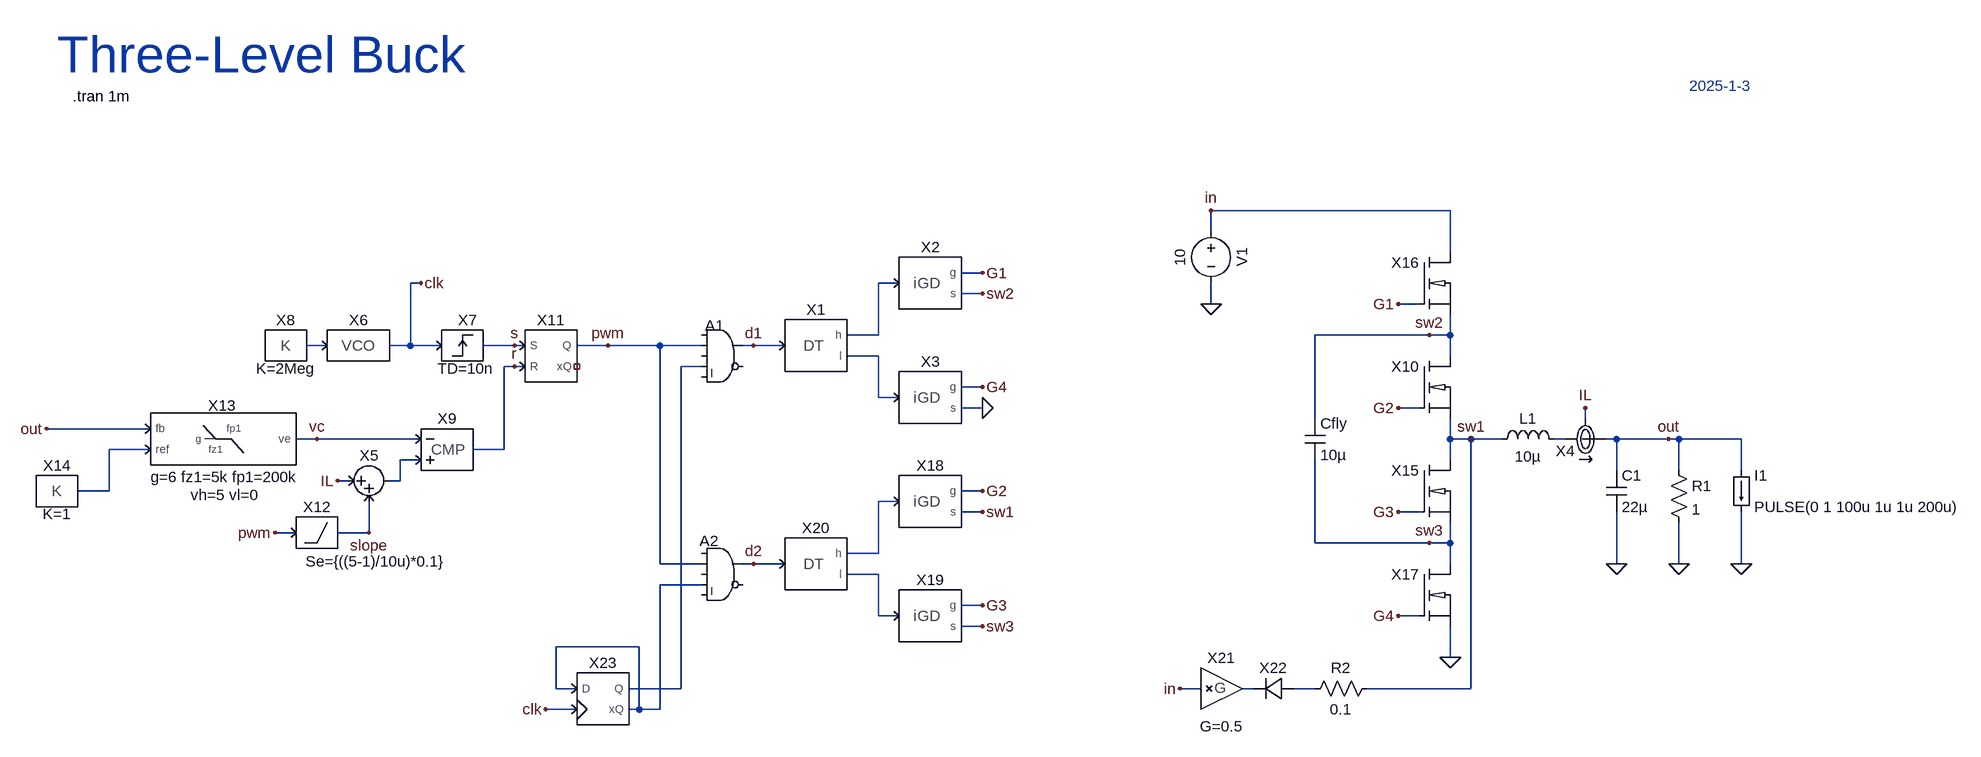
[diagram p0: schematic BUCK_3LV.asc]
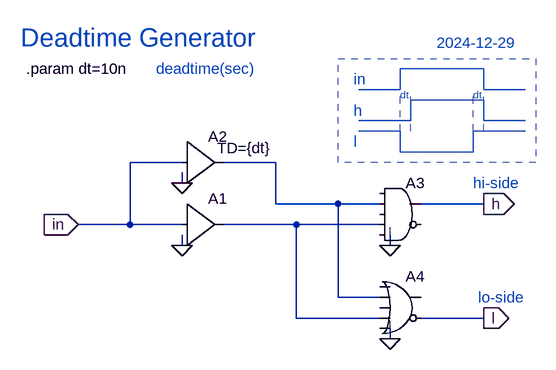
[diagram p1: sub-circuit deadtime.asc]
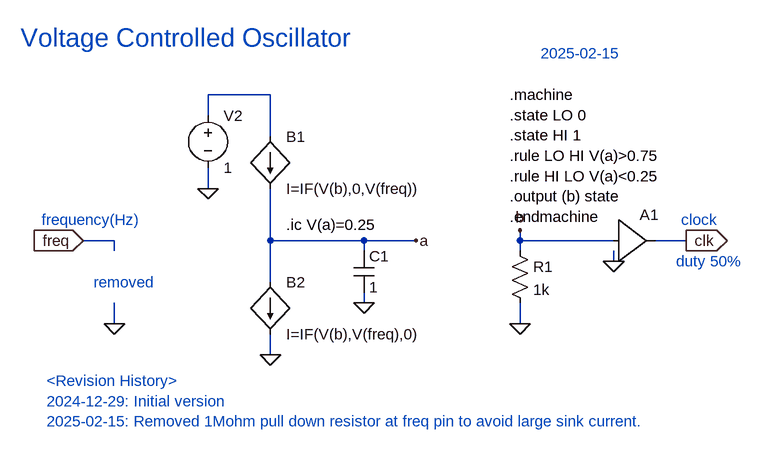
[diagram p2: sub-circuit vco.asc]
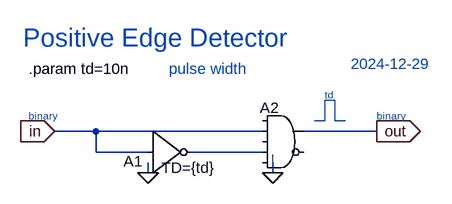
[diagram p3: sub-circuit posedge.asc]
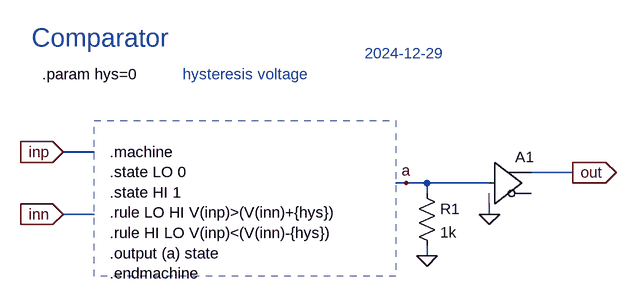
[diagram p4: sub-circuit cmp.asc]
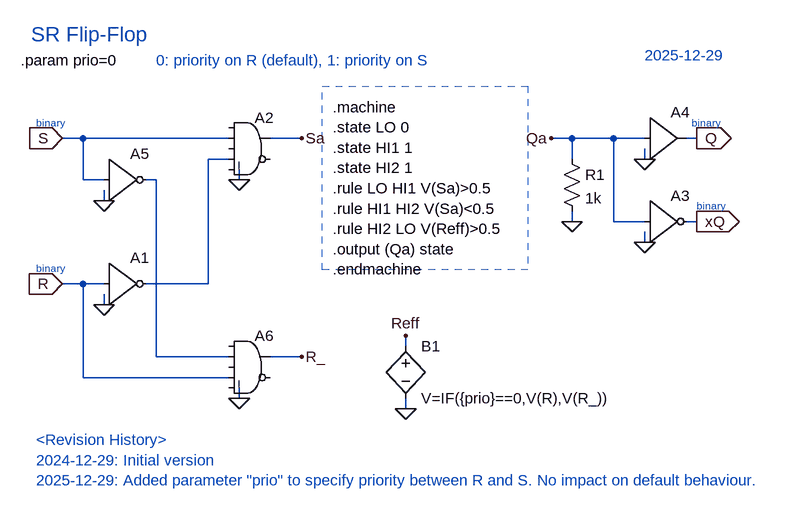
[diagram p5: sub-circuit srff.asc]
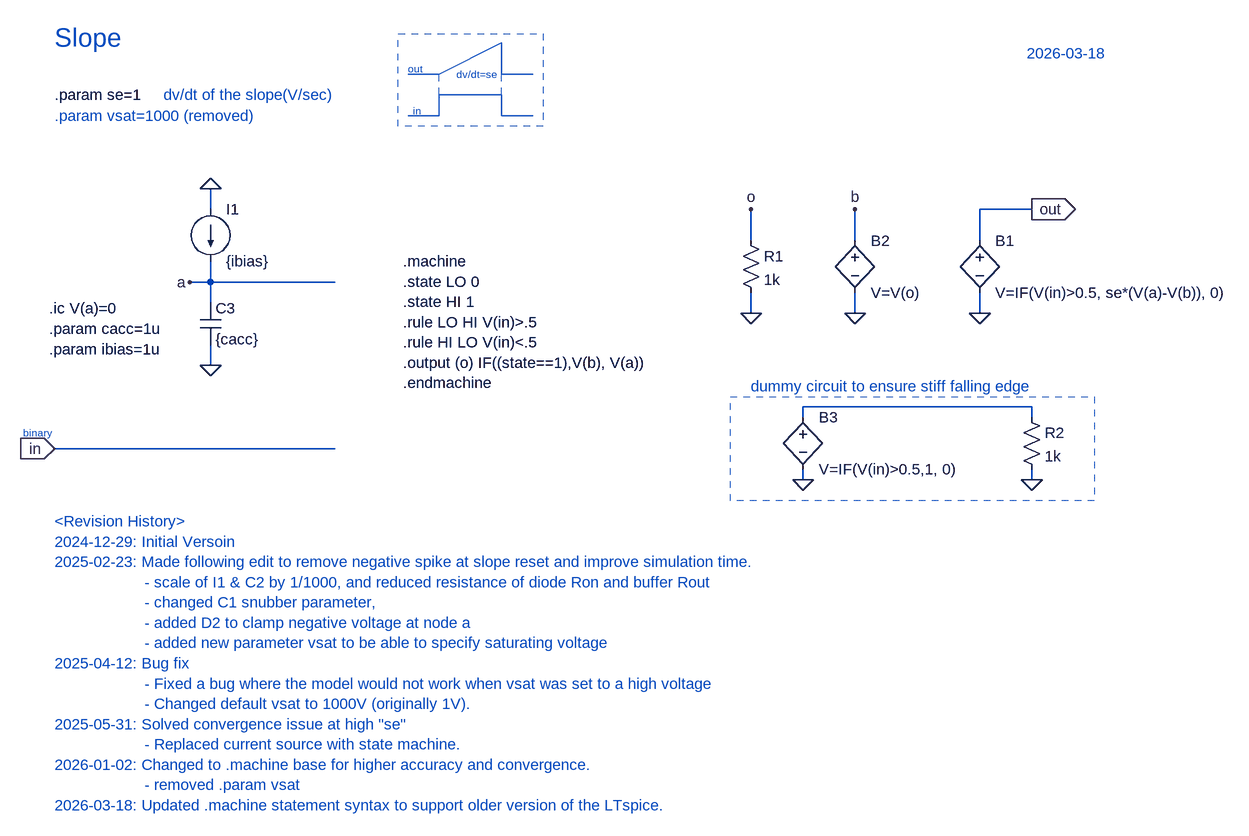
[diagram p6: sub-circuit slope.asc]
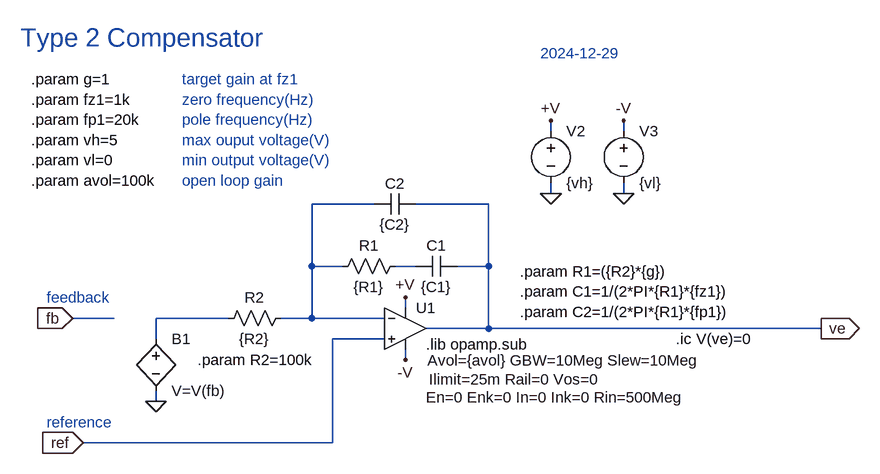
[diagram p7: sub-circuit type2.asc]
BUCK_3LV.asc, the LTspice schematic file:
Version 4
SHEET 1 2724 2028
WIRE 1584 608 1216 608
WIRE 1216 640 1216 608
WIRE 1584 672 1584 608
WIRE 864 704 832 704
WIRE 0 720 -16 720
WIRE 736 720 704 720
WIRE 864 736 832 736
WIRE 1216 752 1216 720
WIRE 1536 752 1504 752
WIRE 704 800 704 720
WIRE 704 800 656 800
WIRE 1552 800 1376 800
WIRE 1584 800 1584 768
WIRE 1584 800 1552 800
WIRE -144 816 -176 816
WIRE -16 816 -16 720
WIRE -16 816 -48 816
WIRE 32 816 -16 816
WIRE 144 816 96 816
WIRE 160 816 144 816
WIRE 288 816 240 816
WIRE 368 816 288 816
WIRE 432 816 368 816
WIRE 512 816 496 816
WIRE 560 816 512 816
WIRE 704 832 656 832
WIRE 1584 832 1584 800
WIRE 144 848 128 848
WIRE 160 848 144 848
WIRE 432 848 400 848
WIRE 864 880 832 880
WIRE 704 896 704 832
WIRE 736 896 704 896
WIRE 864 912 832 912
WIRE 1536 912 1504 912
WIRE 1376 928 1376 800
WIRE 1792 928 1792 912
WIRE -416 944 -576 944
WIRE -160 960 -192 960
WIRE 0 960 -160 960
WIRE 1584 960 1584 928
WIRE 1616 960 1584 960
WIRE 1664 960 1616 960
WIRE 1760 960 1744 960
WIRE 1840 960 1824 960
WIRE 1920 960 1840 960
WIRE 1936 960 1920 960
WIRE 2032 960 1936 960
WIRE -416 976 -480 976
WIRE 128 976 128 848
WIRE 128 976 80 976
WIRE 0 992 -32 992
WIRE 1584 992 1584 960
WIRE 1840 1008 1840 960
WIRE 1936 1008 1936 960
WIRE 2032 1008 2032 960
WIRE -112 1024 -128 1024
WIRE -32 1024 -32 992
WIRE -32 1024 -48 1024
WIRE -480 1040 -480 976
WIRE -480 1040 -528 1040
WIRE 864 1040 832 1040
WIRE 736 1056 704 1056
WIRE 864 1072 832 1072
WIRE 1536 1072 1504 1072
WIRE -192 1104 -224 1104
WIRE -80 1104 -80 1056
WIRE -80 1104 -128 1104
WIRE 1376 1120 1376 992
WIRE 1552 1120 1376 1120
WIRE 1584 1120 1584 1088
WIRE 1584 1120 1552 1120
WIRE 704 1136 704 1056
WIRE 704 1136 656 1136
WIRE 368 1152 368 816
WIRE 432 1152 368 1152
WIRE 512 1152 496 1152
WIRE 560 1152 512 1152
WIRE 1584 1152 1584 1120
WIRE 1840 1152 1840 1072
WIRE 1936 1152 1936 1088
WIRE 2032 1152 2032 1072
WIRE 704 1168 656 1168
WIRE 432 1184 368 1184
WIRE 864 1216 832 1216
WIRE 704 1232 704 1168
WIRE 736 1232 704 1232
WIRE 1536 1232 1504 1232
WIRE 864 1248 832 1248
WIRE 336 1280 208 1280
WIRE 1584 1296 1584 1248
WIRE 208 1344 208 1280
WIRE 240 1344 208 1344
WIRE 400 1344 400 848
WIRE 400 1344 320 1344
WIRE 1200 1344 1168 1344
WIRE 1280 1344 1264 1344
WIRE 1376 1344 1344 1344
WIRE 1616 1344 1616 960
WIRE 1616 1344 1456 1344
WIRE 240 1376 192 1376
WIRE 336 1376 336 1280
WIRE 336 1376 320 1376
WIRE 368 1376 368 1184
WIRE 368 1376 336 1376
FLAG 1216 752 0
FLAG 1840 1152 0
FLAG 1920 960 out
FLAG 1216 608 in
FLAG 1616 960 sw1
FLAG -160 960 vc
FLAG 1936 1152 0
FLAG 512 816 d1
FLAG 1792 912 IL
FLAG -128 1024 IL
FLAG 144 816 s
FLAG 144 848 r
FLAG -224 1104 pwm
FLAG -80 1104 slope
FLAG -576 944 out
FLAG 1584 1296 0
FLAG 1504 752 G1
FLAG 1504 912 G2
FLAG 1504 1072 G3
FLAG 1504 1232 G4
FLAG 1552 800 sw2
FLAG 1552 1120 sw3
FLAG 864 704 G1
FLAG 864 736 sw2
FLAG 864 880 G4
FLAG 864 912 0
FLAG 864 1040 G2
FLAG 864 1072 sw1
FLAG 864 1216 G3
FLAG 0 720 clk
FLAG 864 1248 sw3
FLAG 512 1152 d2
FLAG 288 816 pwm
FLAG 192 1376 clk
FLAG 1168 1344 in
FLAG 2032 1152 0
SYMBOL voltage 1216 624 R0
WINDOW 0 32 56 VTop 2
WINDOW 3 -32 56 VBottom 2
WINDOW 123 0 0 Left 0
WINDOW 39 0 0 Left 0
SYMATTR InstName V1
SYMATTR Value 10
SYMBOL ind 1648 976 R270
WINDOW 0 32 56 VTop 2
WINDOW 3 5 56 VBottom 2
SYMATTR InstName L1
SYMATTR Value 10µ
SYMBOL cap 1824 1008 R0
SYMATTR InstName C1
SYMATTR Value 22µ
SYMATTR SpiceLine Rser=1m
SYMBOL iGD 784 720 R0
SYMATTR InstName X2
SYMBOL iGD 784 896 R0
SYMATTR InstName X3
SYMBOL DEADTIME 608 816 R0
SYMATTR InstName X1
SYMBOL res 1920 992 R0
SYMATTR InstName R1
SYMATTR Value 1
SYMBOL IMON 1792 960 M180
SYMATTR InstName X4
SYMBOL VCO -96 816 R0
SYMATTR InstName X6
SYMBOL POSEDGE 64 816 R0
WINDOW 39 5 51 Bottom 2
SYMATTR SpiceLine TD=10n
SYMATTR InstName X7
SYMBOL CONST -208 816 R0
WINDOW 39 0 51 Bottom 2
SYMATTR SpiceLine K=2Meg
SYMATTR InstName X8
SYMBOL CMP 48 976 R0
SYMATTR InstName X9
SYMBOL SRFF 192 832 R0
SYMATTR InstName X11
SYMBOL SLOPE -160 1104 R0
WINDOW 39 92 60 Bottom 2
SYMATTR SpiceLine Se={((5-1)/10u)*0.1}
SYMATTR InstName X12
SYMBOL TYPE2 -304 960 R0
WINDOW 0 -2 -52 Center 2
WINDOW 39 2 58 Center 2
WINDOW 40 2 86 Center 2
SYMATTR InstName X13
SYMATTR SpiceLine g=6 fz1=5k fp1=200k
SYMBOL CONST -560 1040 R0
WINDOW 39 0 51 Bottom 2
SYMATTR InstName X14
SYMBOL SUM -80 1024 R0
SYMATTR InstName X5
SYMBOL iNMOS 1584 880 R0
SYMATTR InstName X10
SYMBOL iNMOS 1584 1040 R0
SYMATTR InstName X15
SYMBOL iNMOS 1584 720 R0
SYMATTR InstName X16
SYMBOL iNMOS 1584 1200 R0
SYMATTR InstName X17
SYMBOL cap 1360 928 R0
SYMATTR InstName Cfly
SYMATTR Value 10µ
SYMBOL iGD 784 1056 R0
SYMATTR InstName X18
SYMBOL iGD 784 1232 R0
SYMATTR InstName X19
SYMBOL DEADTIME 608 1152 R0
SYMATTR InstName X20
SYMBOL Digital\\and 464 768 R0
WINDOW 0 -27 17 Left 2
SYMATTR InstName A1
SYMBOL Digital\\and 464 1104 R0
WINDOW 0 -35 13 Left 2
SYMATTR InstName A2
SYMBOL PowerSim\\GAIN 1232 1344 R0
WINDOW 39 0 74 Bottom 2
SYMATTR SpiceLine G=0.5
SYMATTR InstName X21
SYMBOL load 2016 1008 R0
WINDOW 123 0 0 Left 0
WINDOW 39 0 0 Left 0
SYMATTR InstName I1
SYMATTR Value PULSE(0 1 100u 1u 1u 200u)
SYMBOL PowerSim\\iD 1312 1344 R90
WINDOW 0 -16 0 VBottom 2
SYMATTR InstName X22
SYMBOL res 1472 1328 R90
WINDOW 0 0 56 VBottom 2
WINDOW 3 32 56 VTop 2
SYMATTR InstName R2
SYMATTR Value 0.1
SYMBOL PowerSim\\DFF 272 1360 R0
SYMATTR InstName X23
TEXT -536 432 Left 2 !.tran 1m
TEXT -560 368 Left 6 ;Three-Level Buck
TEXT 1952 416 Left 2 ;2025-1-3

deadtime.asc, the sub-circuit schematic file:
Version 4
SHEET 1 1412 1312
WIRE 64 288 -16 288
WIRE 208 288 128 288
WIRE 64 320 64 304
WIRE 208 352 208 288
WIRE 304 352 208 352
WIRE 368 352 304 352
WIRE 528 352 432 352
WIRE -16 384 -16 288
WIRE -16 384 -96 384
WIRE 64 384 -16 384
WIRE 240 384 128 384
WIRE 368 384 240 384
WIRE 64 416 64 400
WIRE 384 416 384 400
WIRE 304 496 304 352
WIRE 368 496 304 496
WIRE 240 528 240 384
WIRE 368 528 240 528
WIRE 528 528 432 528
WIRE 384 560 384 544
FLAG -96 384 in
IOPIN -96 384 In
FLAG 64 416 0
FLAG 64 320 0
FLAG 384 416 0
FLAG 384 560 0
FLAG 528 352 h
IOPIN 528 352 Out
FLAG 528 528 l
IOPIN 528 528 Out
SYMBOL Digital\\buf1 64 320 R0
SYMATTR InstName A1
SYMBOL Digital\\buf1 64 224 R0
WINDOW 3 54 42 Left 2
SYMATTR Value TD={dt}
SYMATTR InstName A2
SYMBOL Digital\\and 400 304 R0
SYMATTR InstName A3
SYMBOL Digital\\or 400 448 R0
SYMATTR InstName A4
TEXT -176 144 Left 2 !.param dt=10n
TEXT -184 96 Left 4 ;Deadtime Generator
TEXT 24 144 Left 2 ;deadtime(sec)
TEXT 512 320 Left 2 ;hi-side
TEXT 520 496 Left 2 ;lo-side
TEXT 328 160 Left 2 ;in
TEXT 328 208 Left 2 ;h
TEXT 328 256 Left 2 ;l
TEXT 400 184 Left 1 ;dt
TEXT 512 184 Left 1 ;dt
TEXT 456 104 Left 2 ;2024-12-29
LINE Normal 400 176 336 176
LINE Normal 400 176 400 144
LINE Normal 528 144 400 144
LINE Normal 528 176 528 144
LINE Normal 592 176 528 176
LINE Normal 416 224 336 224
LINE Normal 416 224 416 192
LINE Normal 528 192 416 192
LINE Normal 528 224 528 192
LINE Normal 592 224 528 224
LINE Normal 400 240 336 240
LINE Normal 400 272 400 240
LINE Normal 512 272 400 272
LINE Normal 512 272 512 240
LINE Normal 592 240 512 240
LINE Normal 400 240 400 176 2
LINE Normal 512 240 512 176 2
LINE Normal 416 240 416 176 2
LINE Normal 528 240 528 176 2
RECTANGLE Normal 608 288 304 128 2

vco.asc, the sub-circuit schematic file:
Version 4
SHEET 1 1132 680
WIRE 176 -176 80 -176
WIRE 80 -144 80 -176
WIRE 176 -112 176 -176
WIRE 80 -32 80 -64
WIRE -64 48 -112 48
WIRE 176 48 176 -32
WIRE 320 48 176 48
WIRE 400 48 320 48
WIRE 560 48 560 32
WIRE 704 48 560 48
WIRE 816 48 768 48
WIRE -64 64 -64 48
WIRE 320 64 320 48
WIRE 560 64 560 48
WIRE 704 80 704 64
WIRE 176 112 176 48
WIRE 320 144 320 128
WIRE -64 176 -64 144
WIRE 560 176 560 144
WIRE 176 224 176 192
FLAG 320 144 0
FLAG 560 176 0
FLAG 176 224 0
FLAG 80 -32 0
FLAG 400 48 a
FLAG 560 32 b
FLAG 704 80 0
FLAG 816 48 clk
IOPIN 816 48 Out
FLAG -112 48 freq
IOPIN -112 48 In
FLAG -64 176 0
SYMBOL cap 304 64 R0
SYMATTR InstName C1
SYMATTR Value 1
SYMBOL res 544 48 R0
SYMATTR InstName R1
SYMATTR Value 1k
SYMBOL voltage 80 -160 R0
WINDOW 123 0 0 Left 0
WINDOW 39 0 0 Left 0
SYMATTR InstName V2
SYMATTR Value 1
SYMBOL bi 176 112 R0
SYMATTR InstName B2
SYMATTR Value I=IF(V(b),V(freq),0)
SYMBOL bi 176 -112 R0
SYMATTR InstName B1
SYMATTR Value I=IF(V(b),0,V(freq))
SYMBOL Digital\\buf1 704 -16 R0
SYMATTR InstName A1
TEXT 544 -176 Left 2 !.machine\n.state LO 0\n.state HI 1\n.rule LO HI V(a)>0.75\n.rule HI LO V(a)<0.25\n.output (b) state\n.endmachine
TEXT 200 24 Left 2 !.ic V(a)=0.25
TEXT -208 -264 Left 4 ;Voltage Controlled Oscillator
TEXT -176 16 Left 2 ;frequency(Hz)
TEXT 808 16 Left 2 ;clock
TEXT 800 80 Left 2 ;duty 50%
TEXT 592 -240 Left 2 ;2025-02-15
TEXT -168 264 Left 2 ;<Revision History>\n2024-12-29: Initial version\n2025-02-15: Removed 1Mohm pull down resistor at freq pin to avoid large sink current.
TEXT -96 112 Left 2 ;removed

posedge.asc, the sub-circuit schematic file:
Version 4
SHEET 1 880 680
WIRE 192 160 128 160
WIRE 448 160 192 160
WIRE 624 160 512 160
WIRE 192 192 192 160
WIRE 272 192 192 192
WIRE 448 192 336 192
WIRE 272 224 272 208
WIRE 464 224 464 208
FLAG 128 160 in
IOPIN 128 160 In
FLAG 464 224 0
FLAG 624 160 out
IOPIN 624 160 Out
FLAG 272 224 0
SYMBOL Digital\\and 480 112 R0
WINDOW 0 -36 12 Left 2
SYMATTR InstName A2
SYMBOL Digital\\inv 272 128 R0
WINDOW 3 21 88 Left 2
WINDOW 0 -38 78 Left 2
SYMATTR Value TD={td}
SYMATTR InstName A1
TEXT 88 64 Left 2 !.param td=10n
TEXT 80 16 Left 4 ;Positive Edge Detector
TEXT 88 136 Left 1 ;binary
TEXT 624 136 Left 1 ;binary
TEXT 544 104 Left 1 ;td
TEXT 304 64 Left 2 ;pulse width
TEXT 584 56 Left 2 ;2024-12-29
LINE Normal 544 144 528 144
LINE Normal 544 144 544 112
LINE Normal 560 144 560 112
LINE Normal 576 144 560 144
LINE Normal 544 112 560 112

cmp.asc, the sub-circuit schematic file:
Version 4
SHEET 1 1276 680
WIRE 352 96 304 96
WIRE 1088 128 1024 128
WIRE 832 144 816 144
WIRE 864 144 832 144
WIRE 960 144 864 144
WIRE 864 160 864 144
WIRE 352 192 304 192
WIRE 960 192 960 176
WIRE 864 256 864 240
FLAG 304 96 inp
IOPIN 304 96 In
FLAG 304 192 inn
IOPIN 304 192 In
FLAG 1088 128 out
IOPIN 1088 128 Out
FLAG 864 256 0
FLAG 832 144 a
FLAG 960 192 0
SYMBOL res 848 144 R0
SYMATTR InstName R1
SYMATTR Value 1k
SYMBOL Digital\\buf 960 80 R0
SYMATTR InstName A1
TEXT 376 96 Left 2 !.machine\n.state LO 0\n.state HI 1\n.rule LO HI V(inp)>(V(inn)+{hys})\n.rule HI LO V(inp)<(V(inn)-{hys})\n.output (a) state\n.endmachine
TEXT 272 -24 Left 2 !.param hys=0
TEXT 256 -80 Left 4 ;Comparator
TEXT 488 -24 Left 2 ;hysteresis voltage
TEXT 768 -56 Left 2 ;2024-12-29
RECTANGLE Normal 816 288 352 48 2

srff.asc, the sub-circuit schematic file:
Version 4.1
SHEET 1 928 680
WIRE -272 -496 -304 -496
WIRE -48 -496 -272 -496
WIRE 64 -496 16 -496
WIRE 480 -496 448 -496
WIRE 544 -496 480 -496
WIRE 592 -496 544 -496
WIRE 672 -496 656 -496
WIRE -48 -464 -80 -464
WIRE 480 -464 480 -496
WIRE 592 -464 592 -480
WIRE -272 -432 -272 -496
WIRE -240 -432 -272 -432
WIRE -160 -432 -176 -432
WIRE -32 -432 -32 -448
WIRE -240 -400 -240 -416
WIRE 480 -368 480 -384
WIRE 544 -368 544 -496
WIRE 592 -368 544 -368
WIRE 672 -368 656 -368
WIRE 592 -336 592 -352
WIRE -272 -272 -304 -272
WIRE -240 -272 -272 -272
WIRE -80 -272 -80 -464
WIRE -80 -272 -176 -272
WIRE -240 -240 -240 -256
WIRE 224 -176 224 -192
WIRE -160 -160 -160 -432
WIRE -48 -160 -160 -160
WIRE 64 -160 16 -160
WIRE -272 -128 -272 -272
WIRE -48 -128 -272 -128
WIRE -32 -96 -32 -112
WIRE 224 -80 224 -96
FLAG -304 -496 S
IOPIN -304 -496 In
FLAG -304 -272 R
IOPIN -304 -272 In
FLAG -240 -240 0
FLAG -32 -432 0
FLAG 64 -496 Sa
FLAG 592 -336 0
FLAG 672 -496 Q
IOPIN 672 -496 Out
FLAG 672 -368 xQ
IOPIN 672 -368 Out
FLAG 592 -464 0
FLAG 448 -496 Qa
FLAG 480 -368 0
FLAG 224 -80 0
FLAG 224 -192 Reff
FLAG -240 -400 0
FLAG -32 -96 0
FLAG 64 -160 R_
SYMBOL Digital\\inv -240 -336 R0
SYMATTR InstName A1
SYMBOL Digital\\and -16 -544 R0
SYMATTR InstName A2
SYMBOL Digital\\inv 592 -432 R0
SYMATTR InstName A3
SYMBOL Digital\\buf1 592 -560 R0
SYMATTR InstName A4
SYMBOL res 464 -480 R0
SYMATTR InstName R1
SYMATTR Value 1k
SYMBOL bv 224 -192 R0
SYMATTR InstName B1
SYMATTR Value V=IF({prio}==0,V(R),V(R_))
SYMBOL Digital\\inv -240 -496 R0
SYMATTR InstName A5
SYMBOL Digital\\and -16 -208 R0
SYMATTR InstName A6
TEXT 112 -544 Left 2 !.machine\n.state LO 0\n.state HI1 1\n.state HI2 1\n.rule LO HI1 V(Sa)>0.5\n.rule HI1 HI2 V(Sa)<0.5\n.rule HI2 LO V(Reff)>0.5\n.output (Qa) state\n.endmachine
TEXT -352 -656 Left 3 ;SR Flip-Flop
TEXT -344 -520 Left 1 ;binary
TEXT -344 -296 Left 1 ;binary
TEXT 664 -520 Left 1 ;binary
TEXT 672 -392 Left 1 ;binary
TEXT 592 -624 Left 2 ;2025-12-29
TEXT -368 -616 Left 2 !.param prio=0
TEXT -160 -616 Left 2 ;0: priority on R (default), 1: priority on S
TEXT -344 -32 Left 2 ;<Revision History>\n2024-12-29: Initial version\n2025-12-29: Added parameter "prio" to specify priority between R and S. No impact on default behaviour.
RECTANGLE Normal 412 -294 96 -576 2

slope.asc, the sub-circuit schematic file:
Version 4.1
SHEET 1 2080 1228
WIRE -64 288 -64 256
WIRE 1200 288 1120 288
WIRE 768 336 768 288
WIRE 928 336 928 288
WIRE 1120 336 1120 288
WIRE -64 400 -64 368
WIRE -64 400 -96 400
WIRE 128 400 -64 400
WIRE -64 432 -64 400
WIRE 768 448 768 416
WIRE 928 448 928 416
WIRE 1120 448 1120 416
WIRE -64 528 -64 496
WIRE 1200 592 848 592
WIRE 848 608 848 592
WIRE 1200 608 1200 592
WIRE 128 656 -304 656
WIRE 848 704 848 688
WIRE 1200 704 1200 688
FLAG -304 656 in
IOPIN -304 656 In
FLAG -64 256 0
FLAG -64 528 0
FLAG 1200 288 out
IOPIN 1200 288 Out
FLAG -96 400 a
FLAG 1120 448 0
FLAG 768 448 0
FLAG 768 288 o
FLAG 928 448 0
FLAG 928 288 b
FLAG 1200 704 0
FLAG 848 704 0
SYMBOL current -64 288 R0
SYMATTR InstName I1
SYMATTR Value {ibias}
SYMBOL cap -80 432 R0
SYMATTR InstName C3
SYMATTR Value {cacc}
SYMBOL bv 1120 320 R0
SYMATTR InstName B1
SYMATTR Value V=IF(V(in)>0.5, se*(V(a)-V(b)), 0)
SYMBOL res 752 320 R0
SYMATTR InstName R1
SYMATTR Value 1k
SYMBOL bv 928 320 R0
SYMATTR InstName B2
SYMATTR Value V=V(o)
SYMBOL bv 848 592 R0
SYMATTR InstName B3
SYMATTR Value V=IF(V(in)>0.5,1, 0)
SYMBOL res 1184 592 R0
SYMATTR InstName R2
SYMATTR Value 1k
TEXT -304 112 Left 2 !.param se=1
TEXT -304 24 Left 4 ;Slope
TEXT -352 632 Left 1 ;binary
TEXT -136 112 Left 2 ;dv/dt of the slope(V/sec)
TEXT 248 136 Left 1 ;in
TEXT 240 72 Left 1 ;out
TEXT 376 80 Right 1 ;dv/dt=se
TEXT 1192 48 Left 2 ;2026-03-18
TEXT -304 768 Left 2 ;<Revision History>\n2024-12-29: Initial Versoin\n2025-02-23: Made following edit to remove negative spike at slope reset and improve simulation time.\n                    - scale of I1 & C2 by 1/1000, and reduced resistance of diode Ron and buffer Rout\n                    - changed C1 snubber parameter, \n                    - added D2 to clamp negative voltage at node a \n                    - added new parameter vsat to be able to specify saturating voltage\n2025-04-12: Bug fix \n                    - Fixed a bug where the model would not work when vsat was set to a high voltage \n                    - Changed default vsat to 1000V (originally 1V).\n2025-05-31: Solved convergence issue at high "se" \n                    - Replaced current source with state machine.\n2026-01-02: Changed to .machine base for higher accuracy and convergence.\n                    - removed .param vsat\n2026-03-18: Updated .machine statement syntax to support older version of the LTspice.
TEXT -304 144 Left 2 ;.param vsat=1000 (removed)
TEXT -312 472 Left 2 !.param cacc=1u\n.param ibias=1u
TEXT -312 440 Left 2 !.ic V(a)=0
TEXT 232 368 Left 2 !.machine\n.state LO 0\n.state HI 1\n.rule LO HI V(in)>.5\n.rule HI LO V(in)<.5\n.output (o) IF((state==1),V(b), V(a))\n.endmachine
TEXT 768 560 Left 2 ;dummy circuit to ensure stiff falling edge
LINE Normal 288 144 240 144
LINE Normal 288 144 288 112
LINE Normal 384 112 288 112
LINE Normal 384 144 384 112
LINE Normal 432 144 384 144
LINE Normal 288 80 240 80
LINE Normal 288 80 384 32
LINE Normal 384 80 384 32
LINE Normal 432 80 384 80
LINE Normal 288 112 288 80 1
LINE Normal 384 112 384 80 1
RECTANGLE Normal 448 160 225 18 2
RECTANGLE Normal 1296 736 736 576 2

type2.asc, the sub-circuit schematic file:
Version 4
SHEET 1 1008 680
WIRE 464 -144 464 -160
WIRE 576 -144 576 -160
WIRE 464 -48 464 -64
WIRE 576 -48 576 -64
WIRE 192 -32 96 -32
WIRE 368 -32 256 -32
WIRE 96 64 96 -32
WIRE 144 64 96 64
WIRE 256 64 224 64
WIRE 368 64 368 -32
WIRE 368 64 320 64
WIRE 240 128 240 112
WIRE -208 144 -272 144
WIRE -32 144 -144 144
WIRE 96 144 96 64
WIRE 96 144 48 144
WIRE 208 144 96 144
WIRE 368 160 368 64
WIRE 368 160 272 160
WIRE 880 160 368 160
WIRE -144 176 -144 144
WIRE 208 176 128 176
WIRE 240 208 240 192
WIRE -144 272 -144 256
WIRE 128 336 128 176
WIRE 128 336 -256 336
FLAG -272 144 fb
IOPIN -272 144 In
FLAG -256 336 ref
IOPIN -256 336 In
FLAG -144 272 0
FLAG 880 160 ve
IOPIN 880 160 Out
FLAG 576 -48 0
FLAG 464 -48 0
FLAG 464 -160 +V
FLAG 576 -160 -V
FLAG 240 112 +V
FLAG 240 208 -V
SYMBOL res 240 48 R90
WINDOW 0 0 56 VBottom 2
WINDOW 3 32 56 VTop 2
SYMATTR InstName R1
SYMATTR Value {R1}
SYMBOL cap 320 48 R90
WINDOW 0 0 32 VBottom 2
WINDOW 3 32 32 VTop 2
SYMATTR InstName C1
SYMATTR Value {C1}
SYMBOL cap 256 -48 R90
WINDOW 0 0 32 VBottom 2
WINDOW 3 32 32 VTop 2
SYMATTR InstName C2
SYMATTR Value {C2}
SYMBOL bv -144 160 R0
SYMATTR InstName B1
SYMATTR Value V=V(fb)
SYMBOL res 64 128 R90
WINDOW 0 0 56 VBottom 2
WINDOW 3 32 56 VTop 2
SYMATTR InstName R2
SYMATTR Value {R2}
SYMBOL UniversalOpAmp2 240 160 R0
WINDOW 123 34 49 Left 2
WINDOW 39 36 78 Left 2
WINDOW 40 32 106 Left 2
SYMATTR Value2 Avol={avol} GBW=10Meg Slew=10Meg
SYMATTR InstName U1
SYMBOL voltage 464 -160 R0
SYMATTR InstName V2
SYMATTR Value {vh}
SYMBOL voltage 576 -160 R0
SYMATTR InstName V3
SYMATTR Value {vl}
TEXT 272 184 Left 2 !.lib opamp.sub
TEXT -336 -224 Left 2 !.param g=1\n.param fz1=1k\n.param fp1=20k\n.param vh=5\n.param vl=0\n.param avol=100k
TEXT 416 72 Left 2 !.param R1=({R2}*{g})\n.param C1=1/(2*PI*{R1}*{fz1})\n.param C2=1/(2*PI*{R1}*{fp1})
TEXT -352 -288 Left 4 ;Type 2 Compensator
TEXT -80 208 Left 2 !.param R2=100k
TEXT -104 -224 Left 2 ;target gain at fz1\nzero frequency(Hz)\npole frequency(Hz)\nmax ouput voltage(V)\nmin output voltage(V)\nopen loop gain
TEXT -312 112 Left 2 ;feedback
TEXT -312 304 Left 2 ;reference
TEXT 656 176 Left 2 !.ic V(ve)=0
TEXT 448 -264 Left 2 ;2024-12-29

sum.asc, the sub-circuit schematic file:
Version 4
SHEET 1 880 680
WIRE 288 96 208 96
WIRE 208 112 208 96
WIRE 96 128 48 128
WIRE 96 176 48 176
WIRE 208 208 208 192
FLAG 48 128 IN1
IOPIN 48 128 In
FLAG 48 176 IN2
IOPIN 48 176 In
FLAG 208 208 0
FLAG 288 96 OUT
IOPIN 288 96 Out
SYMBOL bv 208 96 R0
SYMATTR InstName B1
SYMATTR Value V=V(IN1)+V(IN2)
TEXT -16 32 Left 4 ;SUM
TEXT 200 40 Left 2 ;2024-12-29

gain.asc, the sub-circuit schematic file:
Version 4
SHEET 1 880 680
WIRE 0 64 -48 64
WIRE 240 64 144 64
WIRE 144 96 144 64
WIRE 144 192 144 176
FLAG 144 192 0
FLAG 240 64 out
IOPIN 240 64 Out
FLAG -48 64 in
IOPIN -48 64 In
SYMBOL bv 144 80 R0
WINDOW 3 23 92 Left 2
SYMATTR Value V={G}*V(in)
SYMATTR InstName B1
TEXT -88 8 Left 2 !.param G=1
TEXT -88 -40 Left 4 ;GAIN
TEXT 144 -32 Left 2 ;2024-12-29

dff.asc, the sub-circuit schematic file:
Version 4.1
SHEET 1 1208 680
WIRE -16 -496 -192 -496
WIRE 752 -496 704 -496
WIRE 848 -496 752 -496
WIRE 896 -496 848 -496
WIRE 976 -496 960 -496
WIRE 752 -464 752 -496
WIRE 896 -464 896 -480
WIRE -32 -368 -160 -368
WIRE 848 -368 848 -496
WIRE 896 -368 848 -368
WIRE 976 -368 960 -368
WIRE 752 -352 752 -384
WIRE 896 -336 896 -352
FLAG -192 -496 D
IOPIN -192 -496 In
FLAG -160 -368 CLK
IOPIN -160 -368 In
FLAG 976 -496 Q
IOPIN 976 -496 Out
FLAG 976 -368 xQ
IOPIN 976 -368 Out
FLAG 896 -336 0
FLAG 896 -464 0
FLAG 752 -352 0
FLAG 704 -496 o
SYMBOL Digital\\inv 896 -432 R0
SYMATTR InstName A1
SYMBOL Digital\\buf1 896 -560 R0
SYMATTR InstName A2
SYMBOL res 736 -480 R0
SYMATTR InstName R1
SYMATTR Value 1k
TEXT -256 -648 Left 3 ;D Flip-Flop
TEXT -232 -520 Left 1 ;binary
TEXT -200 -392 Left 1 ;binary
TEXT 968 -520 Left 1 ;binary
TEXT 976 -392 Left 1 ;binary
TEXT 976 -656 Left 2 ;2026-01-02
TEXT 144 -528 Left 2 !.machine\n.state LO 0\n.state LATCH 1\n.state HI 2\n.rule LO LATCH V(clk)>.5\n.rule LATCH HI  V(clk)>.9\n.rule * LO V(clk)<.5\n.output (o) IF((state==1),V(D),V(Q))  \n.endmachine
TEXT -264 -200 Left 2 ;<Revision History>\n2025-01-03: Initial version\n2026-01-02: Changed to .machine base state machine instead of Ltspice default DFF to avoid unexpected behaviour.

The netlist it stands for:
* BUCK_3LV.asc
V1 in 0 10
L1 sw1 N005 10µ
C1 out 0 22µ Rser=1m
XX2 N001 G1 sw2 iGD  ; pins in g s
XX3 N003 G4 0 iGD  ; pins in g s
XX1 d1 N003 N001 deadtime params: dt=10n
R1 out 0 1
XX4 out IL N005 IMON rsns=10u  ; pins n out p
XX6 N002 clk vco
XX7 clk s posedge params: TD=10n
XX8 N002 CONST K=2Meg  ; pins K
XX9 vc N007 r cmp params: hys=0
XX11 r s pwm NC_01 srff params: prio=0
XX12 pwm slope slope params: Se={((5-1)/10u)*0.1}
XX13 out N006 vc type2 params: avol=100k g=6 fz1=5k fp1=200k vh=5 vl=0
XX14 N006 CONST K=1  ; pins K
XX5 IL slope N007 sum
XX10 sw2 G2 sw1 iNMOS params: esl=1f rsnb=1k csnb=10p ron=10m  ; pins D G S
XX15 sw1 G3 sw3 iNMOS params: esl=1f rsnb=1k csnb=10p ron=10m  ; pins D G S
XX16 in G1 sw2 iNMOS params: esl=1f rsnb=1k csnb=10p ron=10m  ; pins D G S
XX17 sw3 G4 0 iNMOS params: esl=1f rsnb=1k csnb=10p ron=10m  ; pins D G S
Cfly sw2 sw3 10µ
XX18 N008 G2 sw1 iGD  ; pins in g s
XX19 N009 G3 sw3 iGD  ; pins in g s
XX20 d2 N009 N008 deadtime params: dt=10n
A1 0 pwm 0 N004 0 0 d1 0 AND
A2 0 pwm 0 N010 0 0 d2 0 AND
XX21 in N011 gain params: G=0.5
I1 out 0 PULSE(0 1 100u 1u 1u 200u)
XX22 N012 N011 iD params: von=1n ron=10m esl=1f rsnb=1k csnb=10p  ; pins AN CA
R2 sw1 N012 0.1
XX23 clk N010 N004 N010 dff

* block symbol definitions
.subckt deadtime in l h
A1 in 0 0 0 0 0 N002 0 BUF
A2 in 0 0 0 0 0 N001 0 BUF TD={dt}
A3 0 N001 0 N002 0 0 h 0 AND
A4 0 N001 0 N002 0 l 0 0 OR
.param dt=10n
* Deadtime Generator
* deadtime(sec)
* hi-side
* lo-side
* in
* h
* l
* dt
* dt
* 2024-12-29
.ends deadtime

.subckt vco freq clk
C1 a 0 1
R1 b 0 1k
V2 N001 0 1
B2 a 0 I=IF(V(b),V(freq),0)
B1 N001 a I=IF(V(b),0,V(freq))
A1 b 0 0 0 0 0 clk 0 BUF
.machine
.state LO 0
.state HI 1
.rule LO HI V(a)>0.75
.rule HI LO V(a)<0.25
.output (b) state
.endmachine
.ic V(a)=0.25
* Voltage Controlled Oscillator
* frequency(Hz)
* clock
* duty 50%
* 2025-02-15
* <Revision History>
* 2024-12-29: Initial version
* 2025-02-15: Removed 1Mohm pull down resistor at freq pin to avoid large sink current.
* removed
.ends vco

.subckt posedge in out
A2 0 in 0 N001 0 0 out 0 AND
A1 in 0 0 0 0 N001 0 0 BUF TD={td}
.param td=10n
* Positive Edge Detector
* binary
* binary
* td
* pulse width
* 2024-12-29
.ends posedge

.subckt cmp inn inp out
R1 a 0 1k
A1 a 0 0 0 0 0 out 0 BUF
.machine
.state LO 0
.state HI 1
.rule LO HI V(inp)>(V(inn)+{hys})
.rule HI LO V(inp)<(V(inn)-{hys})
.output (a) state
.endmachine
.param hys=0
* Comparator
* hysteresis voltage
* 2024-12-29
.ends cmp

.subckt srff R S Q xQ
A1 R 0 0 0 0 N001 0 0 BUF
A2 0 S 0 N001 0 0 Sa 0 AND
A3 Qa 0 0 0 0 xQ 0 0 BUF
A4 Qa 0 0 0 0 0 Q 0 BUF
R1 Qa 0 1k
B1 Reff 0 V=IF({prio}==0,V(R),V(R_))
A5 S 0 0 0 0 N002 0 0 BUF
A6 0 N002 0 R 0 0 R_ 0 AND
.machine
.state LO 0
.state HI1 1
.state HI2 1
.rule LO HI1 V(Sa)>0.5
.rule HI1 HI2 V(Sa)<0.5
.rule HI2 LO V(Reff)>0.5
.output (Qa) state
.endmachine
* SR Flip-Flop
* binary
* binary
* binary
* binary
* 2025-12-29
.param prio=0
* 0: priority on R (default), 1: priority on S
* <Revision History>
* 2024-12-29: Initial version
* 2025-12-29: Added parameter "prio" to specify priority between R and S. No impact on default behaviour.
.ends srff

.subckt slope in out
I1 0 a {ibias}
C3 a 0 {cacc}
B1 out 0 V=IF(V(in)>0.5, se*(V(a)-V(b)), 0)
R1 o 0 1k
B2 b 0 V=V(o)
B3 N001 0 V=IF(V(in)>0.5,1, 0)
R2 N001 0 1k
.param se=1
* Slope
* binary
* dv/dt of the slope(V/sec)
* in
* out
* dv/dt=se
* 2026-03-18
* <Revision History>
* 2024-12-29: Initial Versoin
* 2025-02-23: Made following edit to remove negative spike at slope reset and improve simulation time.
*                     - scale of I1 & C2 by 1/1000, and reduced resistance of diode Ron and buffer Rout
*                     - changed C1 snubber parameter,
*                     - added D2 to clamp negative voltage at node a
*                     - added new parameter vsat to be able to specify saturating voltage
* 2025-04-12: Bug fix
*                     - Fixed a bug where the model would not work when vsat was set to a high voltage
*                     - Changed default vsat to 1000V (originally 1V).
* 2025-05-31: Solved convergence issue at high "se"
*                     - Replaced current source with state machine.
* 2026-01-02: Changed to .machine base for higher accuracy and convergence.
*                     - removed .param vsat
* 2026-03-18: Updated .machine statement syntax to support older version of the LTspice.
* .param vsat=1000 (removed)
.param cacc=1u
.param ibias=1u
.ic V(a)=0
.machine
.state LO 0
.state HI 1
.rule LO HI V(in)>.5
.rule HI LO V(in)<.5
.output (o) IF((state==1),V(b), V(a))
.endmachine
* dummy circuit to ensure stiff falling edge
.ends slope

.subckt type2 fb ref ve
R1 N002 N001 {R1}
C1 ve N002 {C1}
C2 ve N001 {C2}
B1 N003 0 V=V(fb)
R2 N001 N003 {R2}
XU1 ref N001 +V -V ve level2 Avol={avol} GBW=10Meg Slew=10Meg Ilimit=25m Rail=0 Vos=0 En=0 Enk=0 In=0 Ink=0 Rin=500Meg  ; pins In+ In- V+ V- OUT
V2 +V 0 {vh}
V3 -V 0 {vl}
.lib opamp.sub
.param g=1
.param fz1=1k
.param fp1=20k
.param vh=5
.param vl=0
.param avol=100k
.param R1=({R2}*{g})
.param C1=1/(2*PI*{R1}*{fz1})
.param C2=1/(2*PI*{R1}*{fp1})
* Type 2 Compensator
.param R2=100k
* target gain at fz1
* zero frequency(Hz)
* pole frequency(Hz)
* max ouput voltage(V)
* min output voltage(V)
* open loop gain
* feedback
* reference
.ic V(ve)=0
* 2024-12-29
.ends type2

.subckt sum in1 in2 out
B1 OUT 0 V=V(IN1)+V(IN2)
* SUM
* 2024-12-29
.ends sum

.subckt gain in out
B1 out 0 V={G}*V(in)
.param G=1
* GAIN
* 2024-12-29
.ends gain

.subckt dff CLK D Q xQ
A1 o 0 0 0 0 xQ 0 0 BUF
A2 o 0 0 0 0 0 Q 0 BUF
R1 o 0 1k
* D Flip-Flop
* binary
* binary
* binary
* binary
* 2026-01-02
.machine
.state LO 0
.state LATCH 1
.state HI 2
.rule LO LATCH V(clk)>.5
.rule LATCH HI  V(clk)>.9
.rule * LO V(clk)<.5
.output (o) IF((state==1),V(D),V(Q))
.endmachine
* <Revision History>
* 2025-01-03: Initial version
* 2026-01-02: Changed to .machine base state machine instead of Ltspice default DFF to avoid unexpected behaviour.
.ends dff

.tran 1m
* Three-Level Buck
* 2025-1-3
.lib UniversalOpAmp2.lib
.backanno
.end